# Altium schematic sheet connectors.SchDoc
size A4
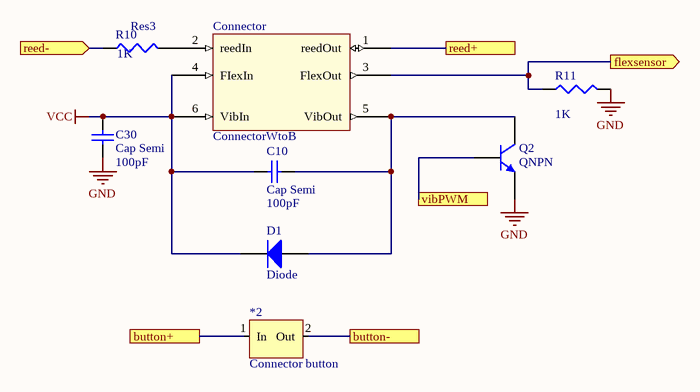
[diagram p0: connectors.SchDoc]

## Parts
*2  Connector button  [Button_connector]
C10  Cap Semi  value 100pF  [C1206]
C30  Cap Semi  value 100pF  [C1206]
Connector  ConnectorWtoB  [Connector_wire_to_PCB]
D1  Diode  [SMC]
Q2  QNPN  [SOT-23B_N]
R10  Res3  value 1K  [J1-0603]
R11  value 1K  [J1-0603]  (hidden comment: Res3)

## Ports
button+, button-, flexsensor (out), reed+, reed- (in), vibPWM

## Nets
GND: C30.1 Q2.3(E) R11.2
VCC: C10.1 C30.2 Connector.4(FIexIn) Connector.6(VibIn) D1.2(K)
button+: *2.1(In) ; port button+
button-: *2.2(Out) ; port button-
flexsensor: Connector.3(FlexOut) R11.1 ; port flexsensor
reed+: Connector.1(reedOut) ; port reed+
reed-: R10.1 ; port reed-
vibPWM: Q2.2(B) ; port vibPWM
NetC10_2: C10.2 Connector.5(VibOut) D1.1(A) Q2.1(C)
NetConnector_2: Connector.2(reedIn) R10.2

## Library data of the parts
C10 C30 = Cap Semi: Capacitor (Semiconductor SIM Model); Published: 8-Jun-2000; LatestRevisionDate: 29-May-2009; LatestRevisionNote: IPC-7351 Footprint Added.; PackageReference: C1206; Publisher: Altium Limited; PackageDescription: Chip Capacitor
D1 = Diode: Default Diode; Published: 8-Jun-2000; LatestRevisionDate: 17-Jul-2002; LatestRevisionNote: Re-released for DXP Platform.; PackageVersion: Sep-1996; PackageReference: SMC; Publisher: Altium Limited; PackageDescription: DO-214-AB/SMC; 2 C-Bend Leads; Body 7.9 x 5.9 mm, inc. leads (LxW); Code_JEDEC: DO-214-AB
Q2 = QNPN: NPN Bipolar Transistor; Published: 8-Jun-2000; LatestRevisionDate: 29-May-2009; LatestRevisionNote: IPC-7351 Footprint Added.; PackageReference: SOT-23B; Publisher: Altium Limited; PackageDescription: 3-Pin SOT-23 Package 0.95 mm Pitch, 2.4 mm Lead Span; PackageVersion: Aug-1999
R10 R11 = Res3: Resistor; Published: 8-Jun-2000; LatestRevisionDate: 29-May-2009; LatestRevisionNote: IPC-7351 Footprint Added.; PackageReference: J1-0603; Publisher: Altium Limited; PackageDescription: Chip Resistor